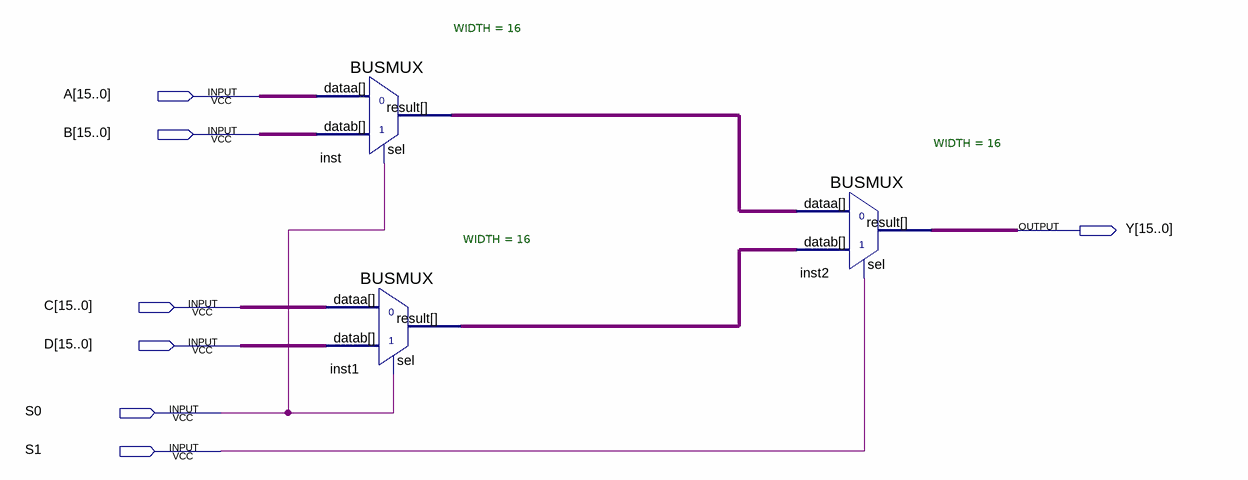
[diagram p0: schematic sheet]
// Quartus schematic Mux41_16Bit.bdf as structural Verilog: 3 symbols, 7 pins
module Mux41_16Bit (
  input  [15:0] A,
  input  [15:0] B,
  input  [15:0] C,
  input  [15:0] D,
  input  S0,
  input  S1,
  output [15:0] Y
);

  wire [15:0] inst1_result, inst_result;

  BUSMUX #(.WIDTH(16)) inst (.datab(B), .sel(S0), .dataa(A), .result(inst_result));
  BUSMUX #(.WIDTH(16)) inst1 (.datab(D), .sel(S0), .dataa(C), .result(inst1_result));
  BUSMUX #(.WIDTH(16)) inst2 (.datab(inst1_result), .sel(S1), .dataa(inst_result), .result(Y));
endmodule
